# Altium schematic sheet CAN-Sheet.SchDoc
size A4; DocumentNumber: 6; SheetNumber: 6; SheetTotal: 8
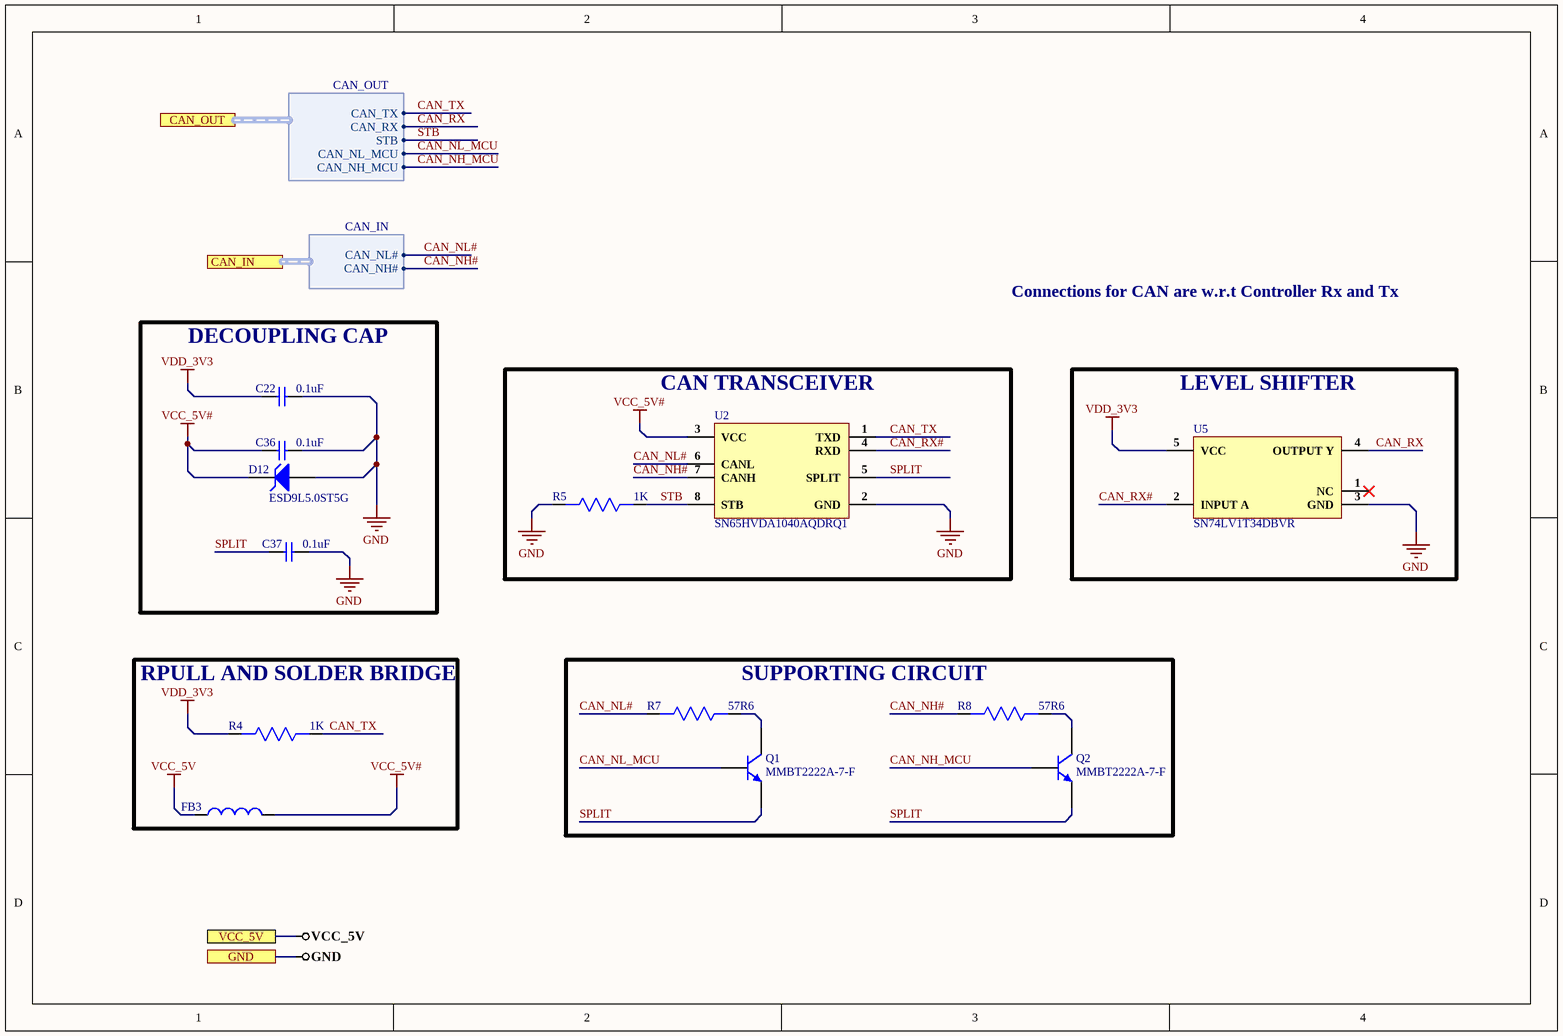
[diagram p0: CAN-Sheet.SchDoc]

## Parts
C22  0.1uF  [Cap 0603]
C36  0.1uF  [Cap0603]
C37  0.1uF  [Cap0603]
D12  ESD9L5.0ST5G  [SOD-923]
FB3  MPZ1608S121ATDH5  [MPZ1608S121ATDH5]  (value not drawn)
Q1  MMBT2222A-7-F  [SOT-23]
Q2  MMBT2222A-7-F  [SOT-23]
R4  1K  [Res0603]
R5  1K  [Res0603]
R7  57R6  [Res0603]
R8  57R6  [Res0603]
U2  SN65HVDA1040AQDRQ1  [SOIC-8]
U5  SN74LV1T34DBVR  [SOT-23-5]

## Blocks framed on the sheet
DECOUPLING CAP: C22 C36 C37 D12
CAN TRANSCEIVER: R5 U2
LEVEL SHIFTER: U5
RPULL AND SOLDER BRIDGE: FB3 R4
SUPPORTING CIRCUIT: Q1 Q2 R7 R8

## Ports
CAN_IN (harness CAN_IN), CAN_OUT (harness CAN_OUT), GND, VCC_5V

## Harnesses
CAN_OUT: CAN_TX, CAN_RX, STB, CAN_NL_MCU, CAN_NH_MCU
CAN_IN: CAN_NL#, CAN_NH#

## Nets
GND: C22.2 C36.2 C37.2 D12.2(A) R5.2 U2.2(GND) U5.3(GND) ; port GND
VCC_5V: FB3.1 ; port VCC_5V
VCC_5V#: C36.1 D12.1(K) FB3.2 U2.3(VCC)
VDD_3V3: C22.1 R4.2 U5.5(VCC)
CAN_NH#: R8.2 U2.7(CANH) ; port CAN_IN.CAN_NH#
CAN_NH_MCU: Q2.1(B) ; port CAN_OUT.CAN_NH_MCU
CAN_NL#: R7.2 U2.6(CANL) ; port CAN_IN.CAN_NL#
CAN_NL_MCU: Q1.1(B) ; port CAN_OUT.CAN_NL_MCU
CAN_RX: U5.4(OUTPUT_Y) ; port CAN_OUT.CAN_RX
CAN_RX#: U2.4(RXD) U5.2(INPUT_A)
CAN_TX: R4.1 U2.1(TXD) ; port CAN_OUT.CAN_TX
SPLIT: C37.1 Q1.2(E) Q2.2(E) U2.5(SPLIT)
STB: R5.1 U2.8(STB) ; port CAN_OUT.STB
NetQ1_3: Q1.3(C) R7.1
NetQ2_3: Q2.3(C) R8.1

Not connected (* = marked no-connect by the designer): U5 1(NC)*

## Notes on the sheet
- Connections for CAN are w.r.t Controller Rx and Tx

## Library data of the parts
C22 C36 C37 = CL10B104KB8NNNC: Cap Ceramic 0.1uF 50VDC X7R 10% SMD 0603 Paper T/R; Manufacturer: Samsung; Capacitance: 100nF; Voltage Rating: 50V; Supplier 1: Digi-Key; Manufacturer Part Number: CL10B104KB8NNNC; RoHS: Yes; Category: Ceramic Capacitors; Stock 1: 3998791; Pricing 1: 1=0.10000, 10=0.03000, 50=0.01640, 100=0.01340, 500=0.00954, 1000=0.00750 (USD); Mount: Surface Mount; Case/Package: 0603; Case Code (Metric): 1608; Case Code (Imperial): 0603; Material: Ceramic; Contact Plating: Tin; Min Operating Temperature: -55°C; Max Operating Temperature: 125°C; Dielectric: X7R; Tolerance: 10%; Package Quantity: 1; Packaging: Tape and Reel; Voltage: 50V; Voltage Rating (DC): 50V; Series: CL; Construction: Flat; Length: 1.6mm; Width: 0.031inch; Height: 0.8mm; Depth: 0.8mm; Thickness: 0.035inch; Radiation Hardening: No; Lead Free: Lead Free; RoHS Compliant: Yes; ComponentLink1URL: https://datasheet.ciiva.com/25803/cl10b104kb8nnnc-25803393.pdf?src-supplier=Digi-Key; ComponentLink1Description: https://datasheet.ciiva.com/25803/cl10b104kb8nnnc-25803393.pdf?src-supplier=Digi-Key; ComponentLink2URL: https://datasheet.ciiva.com/26838/getdatasheetpartid-89097-26838411.pdf?src-supplier=Verical; ComponentLink2Description: https://datasheet.ciiva.com/26838/getdatasheetpartid-89097-26838411.pdf?src-supplier=Verical; ComponentLink3URL: https://datasheet.ciiva.com/29198/456651-da-01-en-vs-kondensator-0605-29198839.pdf?src-supplier=Conrad; ComponentLink3Description: https://datasheet.ciiva.com/29198/456651-da-01-en-vs-kondensator-0605-29198839.pdf?src-supplier=Conrad; Supplier Part Number 1: 1276-1000-1-ND
D12 = ESD9L5.0ST5G: TVS DIODE 5V 9.8V SOD923; Manufacturer: ON Semiconductor; Capacitance: 0.9pF; Direction: Unidirectional; Number of Unidirectional Channels: 1; Min Breakdown Voltage: 5.4V; Power Line Protection: No; Leakage Current: 1uA; Element Configuration: Single; Peak Pulse Current: 1A; Diode Type: ZENER; Reverse Breakdown Voltage: 5.8V; Peak Pulse Power: 150mW; ESD Protection: Yes; Test Current: 1mA; Supplier 1: Digi-Key; Manufacturer Part Number: ESD9L5.0ST5G; RoHS: Yes; Category: ESD and Circuit Protection ICs; Stock 1: 558996; Pricing 1: 1=0.37000, 10=0.25600, 100=0.12500, 500=0.10426, 1000=0.07244, 2000=0.06278 (USD); Case/Package: SOD-923-2; Number of Pins: 2; Contact Plating: Tin,Matte; Min Operating Temperature: -55°C; Max Operating Temperature: 150°C; Package Quantity: 1; Packaging: Tape and Reel; Clamping Voltage: 9.8V; Reverse Standoff Voltage: 5V; Working Voltage: 5V; Resistor Type: Zener; Series: Automotive, AEC-Q101; Number of Elements: 1; Operating Supply Voltage: 5V; Max Surge Current: 1A; Breakdown Voltage: 5.4V; Number of Channels: 1; Polarity: Unidirectional; Termination: SMD/SMT; Max Reverse Leakage Current: 1uA; Max Breakdown Voltage: 5.4V; Number of Lines: 1; Power Dissipation: 150mW; Clamping Voltage-Max: 9.8V; Length: 0.8mm; Width: 0.65mm; Height: 0.4mm; Depth: 0.6mm; Radiation Hardening: No; Lead Free: Lead Free; RoHS Compliant: Yes; REACH SVHC: No SVHC; Halogen Free: Halogen Free; ComponentLink1URL: https://datasheet.ciiva.com/15143/getdatasheetpartid-185186-15143896.pdf?src-supplier=Verical; ComponentLink1Description: https://datasheet.ciiva.com/15143/getdatasheetpartid-185186-15143896.pdf?src-supplier=Verical; ComponentLink2URL: https://datasheet.ciiva.com/4510/esd9l-d-4510647.pdf?src-supplier=Mouser; ComponentLink2Description: https://datasheet.ciiva.com/4510/esd9l-d-4510647.pdf?src-supplier=Mouser; ComponentLink3URL: https://datasheet.ciiva.com/3304/esd9l-d-3304011.pdf?src-supplier=Avnet; ComponentLink3Description: https://datasheet.ciiva.com/3304/esd9l-d-3304011.pdf?src-supplier=Avnet; ComponentLink4URL: https://datasheet.ciiva.com/16437/esd9l-d-16437835.pdf?src-supplier=Future+Electronics; ComponentLink4Description: https://datasheet.ciiva.com/16437/esd9l-d-16437835.pdf?src-supplier=Future+Electronics; ComponentLink5URL: https://datasheet.ciiva.com/339/esd9l-d-339853.pdf?src-supplier=Digi-Key; ComponentLink5Description: https://datasheet.ciiva.com/339/esd9l-d-339853.pdf?src-supplier=Digi-Key; ComponentLink6URL: https://datasheet.ciiva.com/339/esd9l-d-339854.pdf?src-supplier=Digi-Key; ComponentLink6Description: https://datasheet.ciiva.com/339/esd9l-d-339854.pdf?src-supplier=Digi-Key; ComponentLink7URL: https://datasheet.ciiva.com/11195/esd9l-d-11195342.pdf?src-supplier=Avnet; ComponentLink7Description: https://datasheet.ciiva.com/11195/esd9l-d-11195342.pdf?src-supplier=Avnet; ComponentLink8URL: https://datasheet.ciiva.com/25958/esd9l-d-25958446.pdf?src-supplier=Avnet+Europe; ComponentLink8Description: https://datasheet.ciiva.com/25958/esd9l-d-25958446.pdf?src-supplier=Avnet+Europe; ComponentLink9URL: https://datasheet.ciiva.com/339/esd9l-d-339855.pdf?src-supplier=Digi-Key; ComponentLink9Description: https://datasheet.ciiva.com/339/esd9l-d-339855.pdf?src-supplier=Digi-Key; Supplier Part Number 1: ESD9L5.0ST5GOSCT-ND
FB3 = MPZ1608S121ATDH5: Ferrite Beads Multi-Layer 120Ohm 25% 100MHz 2A 45mOhm DCR 0603 Automotive T/R; Manufacturer: TDK; Number of Lines: 1; DC Resistance (DCR): 45mR; Impedance: 120R; Supplier 1: Digi-Key; Manufacturer Part Number: MPZ1608S121ATDH5; RoHS: Yes; Category: Ferrite Beads and Chips; Pricing 1: 1=0.11000, 10=0.08600, 25=0.07720, 50=0.05660, 100=0.04890, 250=0.03860, 500=0.03260, 1000=0.02746 (USD); Mount: Surface Mount; Case/Package: 0603; Case Code (Metric): 1608; Case Code (Imperial): 0603; Weight: 7.1E-05oz; Min Operating Temperature: -55°C; Max Operating Temperature: 125°C; Package Quantity: 4000; Packaging: Tape and Reel; Max Current Rating: 2A; Termination: SMD/SMT; Max DC Current: 2A; Tolerance: 25%; Test Frequency: 100MHz; Length: 0.063inch; Width: 0.031inch; Height: 0.03inch; Ratings: AEC-Q200; RoHS Compliant: Yes; ComponentLink1URL: https://media.digikey.com/pdf/Data%20Sheets/TDK%20PDFs/MPZ_Series_Br.pdf?src-supplier=Digi-Key; ComponentLink1Description: https://media.digikey.com/pdf/Data%20Sheets/TDK%20PDFs/MPZ_Series_Br.pdf?src-supplier=Digi-Key; ComponentLink2URL: http://www.mouser.com/ds/2/400/eads_commercial_power_mpz1608_en-923650.pdf?src-supplier=Mouser; ComponentLink2Description: http://www.mouser.com/ds/2/400/eads_commercial_power_mpz1608_en-923650.pdf?src-supplier=Mouser; ComponentLink3URL: https://product.tdk.com/info/en/catalog/datasheets/beads_automotive_power_mpz1608_en.pdf?src-supplier=Digi-Key; ComponentLink3Description: https://product.tdk.com/info/en/catalog/datasheets/beads_automotive_power_mpz1608_en.pdf?src-supplier=Digi-Key; Supplier Part Number 1: 445-172891-6-ND
Q1 Q2 = MMBT2222A-7-F: TRANS NPN 40V 0.6A SMD SOT23-3; Manufacturer: Diodes; Max Power Dissipation: 300mW; Collector Base Voltage (VCBO): 75V; Max Collector Current: 600mA; hFE Min: 100; Frequency: 300MHz; Number of Elements: 1; Emitter Base Voltage (VEBO): 6V; Collector Emitter Saturation Voltage: 1V; Power Dissipation: 350mW; Element Configuration: Single; Current: 1A; Supplier 1: Digi-Key; Manufacturer Part Number: MMBT2222A-7-F; Stock 1: 2471182; Pricing 1: 1=0.15, 10=0.134, 100=0.0729, 500=0.04486, 1000=0.03059 (USD); Mount: Surface Mount; Case/Package: SOT-23; Number of Pins: 3; Weight: 0.000282oz; Contact Plating: Matte,Tin; Min Operating Temperature: -55°C; Max Operating Temperature: 150°C; Packaging: Tape and Reel; Collector Emitter Voltage (VCEO): 40V; Polarity: NPN; Voltage Rating (DC): 40V; Package Quantity: 3000; Continuous Collector Current: 600mA; Collector Emitter Breakdown Voltage: 40V; Transition Frequency: 300MHz; Max Breakdown Voltage: 40V; Max Frequency: 300MHz; Termination: SMD/SMT; Gain Bandwidth Product: 300MHz; Current Rating: 600mA; Voltage: 40V; Length: 3.05mm; Height: 1mm; Width: 1.4mm; Radiation Hardening: No; Lead Free: Lead Free; REACH SVHC: No SVHC; ComponentLink1URL: http://www.diodes.com/datasheets/ds30041.pdf?src-supplier=Future+Electronics; ComponentLink1Description: http://www.diodes.com/datasheets/ds30041.pdf?src-supplier=Future+Electronics; ComponentLink2URL: http://www.diodes.com/datasheets/ds30041.pdf?src-supplier=Avnet; ComponentLink2Description: http://www.diodes.com/datasheets/ds30041.pdf?src-supplier=Avnet; ComponentLink3URL: https://www.verical.com/server-webapp/html/getDatasheet?partID=82692&src-supplier=Verical; ComponentLink3Description: https://www.verical.com/server-webapp/html/getDatasheet?partID=82692&src-supplier=Verical; ComponentLink4URL: https://www.diodes.com/assets/Datasheets/ds30041.pdf?src-supplier=Digi-Key; ComponentLink4Description: https://www.diodes.com/assets/Datasheets/ds30041.pdf?src-supplier=Digi-Key; ComponentLink5URL: http://www.diodes.com/datasheets/ds30041.pdf?src-supplier=Avnet+Europe; ComponentLink5Description: http://www.diodes.com/datasheets/ds30041.pdf?src-supplier=Avnet+Europe; ComponentLink6URL: http://www.diodes.com/datasheets/ds30041.pdf?src-supplier=Element14; ComponentLink6Description: http://www.diodes.com/datasheets/ds30041.pdf?src-supplier=Element14; Supplier Part Number 1: MMBT2222A-FDIDKR-ND
R4 R5 = RC0603JR-071KL: RES SMD 1K 0.1W 0603  75 V, Thick Film; Manufacturer: Yageo; Resistance: 1kR; Tolerance: 5%; Temperature Coefficient: 100ppm/°C; Voltage Rating (DC): 50V; Power Rating: 100mW; Body Length: 1.6mm; Supplier 1: Digi-Key; Manufacturer Part Number: RC0603JR-071KL; RoHS: Yes; Category: Chip SMD Resistors; Stock 1: 1727570; Pricing 1: 1=0.10000, 10=0.02000, 100=0.00800, 1000=0.00360, 2500=0.00312 (USD); Case/Package: 0603; Number of Pins: 2; Contact Plating: Tin,Matte; Case Code (Imperial): 0603; Case Code (Metric): 1608; Size Code: 0603; Min Operating Temperature: -55°C; Max Operating Temperature: 155°C; Resistor Type: Thick Film; Packaging: Tape and Reel; Package Quantity: 5000; Voltage Rating: 50V; Termination: SMD/SMT; Series: RC; Resistance Tolerance: 5%; Construction: Rectangular; Length: 1.6mm; Width: 0.8mm; Height: 0.45mm; Depth: 0.8mm; Radiation Hardening: No; REACH SVHC: Unknown; Lead Free: Lead Free; Military Standard: Not; RoHS Compliant: Yes; Supplier Part Number 1: 311-1.0KGRCT-ND
R7 R8 = RC0603FR-0757R6L: RES SMD 57.6 OHM 1% 1/10W 0603; Manufacturer: Yageo; Resistance: 57.6R; Temperature Coefficient: 100ppm/°C; Power Rating: 100mW; Voltage Rating: 50V; Supplier 1: Digi-Key; Manufacturer Part Number: RC0603FR-0757R6L; RoHS: Yes; Category: Chip SMD Resistors; Stock 1: 27520; Pricing 1: 1=0.10000, 10=0.02400, 100=0.00970, 1000=0.00436, 2500=0.00378 (USD); Case/Package: 0603; Contact Plating: Tin,Matte; Case Code (Metric): 1608; Case Code (Imperial): 0603; Min Operating Temperature: -55°C; Max Operating Temperature: 155°C; Tolerance: 1%; Resistor Type: Thick Film; Package Quantity: 1; Packaging: Tape and Reel; Number of Terminations: 2; Termination: SMD/SMT; Max Power Dissipation: 100mW; Voltage Rating (DC): 50V; Features: Moisture Resistant; Series: RC; Construction: Rectangular; Length: 1.6mm; Width: 0.031inch; Height: 0.022inch; Depth: 0.8mm; Military Standard: Not; Lead Free: Lead Free; RoHS Compliant: Yes; ComponentLink1URL: https://datasheet.ciiva.com/2455/pyu-r-int-thick-7-2455376.pdf?src-supplier=Digi-Key; ComponentLink1Description: https://datasheet.ciiva.com/2455/pyu-r-int-thick-7-2455376.pdf?src-supplier=Digi-Key; ComponentLink2URL: https://datasheet.ciiva.com/28398/pyu-rc0603-51-rohs-l-4-28398203.pdf?src-supplier=Avnet+Europe; ComponentLink2Description: https://datasheet.ciiva.com/28398/pyu-rc0603-51-rohs-l-4-28398203.pdf?src-supplier=Avnet+Europe; ComponentLink3URL: https://datasheet.ciiva.com/2455/pyu-r-int-thick-7-2455374.pdf?src-supplier=Digi-Key; ComponentLink3Description: https://datasheet.ciiva.com/2455/pyu-r-int-thick-7-2455374.pdf?src-supplier=Digi-Key; ComponentLink4URL: https://datasheet.ciiva.com/12561/rc0603-272842-12561230.pdf?src-supplier=Mouser; ComponentLink4Description: https://datasheet.ciiva.com/12561/rc0603-272842-12561230.pdf?src-supplier=Mouser; ComponentLink5URL: https://datasheet.ciiva.com/2455/pyu-r-int-thick-7-2455375.pdf?src-supplier=Digi-Key; ComponentLink5Description: https://datasheet.ciiva.com/2455/pyu-r-int-thick-7-2455375.pdf?src-supplier=Digi-Key; Supplier Part Number 1: 311-57.6HRCT-ND
U2 = SN65HVDA1040AQDRQ1: IC TRANSCEIVER HALF 1/1 8SOIC; Manufacturer: Texas Instruments; Number of Transmit Buffers: 1; Min Supply Voltage: 4.75V; Max Supply Voltage: 5.25V; Data Rate: 1Mbps; Operating Supply Voltage: 5V; Nominal Supply Current: 70mA; Supplier 1: Arrow Electronics; Manufacturer Part Number: SN65HVDA1040AQDRQ1; RoHS: Yes; Category: Interface ICs; Stock 1: 20; Pricing 1: 1=1.73580, 10=1.50150 (USD); Case/Package: D; Number of Pins: 8; Contact Plating: Gold; Min Operating Temperature: -40°C; Max Operating Temperature: 125°C; Number of Receive Buffers: 1; Packaging: Tape and Reel; Package Quantity: 2500; Number of Transceivers: 1; Max Supply Current: 70mA; Series: -; Supply Current: 70mA; Radiation Hardening: No; REACH SVHC: No SVHC; Lead Free: Lead Free; RoHS Compliant: Yes; ComponentLink1URL: https://datasheet.ciiva.com/28652/1787993-28652354.pdf?src-supplier=Element14; ComponentLink1Description: https://datasheet.ciiva.com/28652/1787993-28652354.pdf?src-supplier=Element14; ComponentLink2URL: https://datasheet.ciiva.com/41461/001187135-da-01-en-ic-transcv-sn65hvda1040aqdrq1-soic-8-tid-41461891.pdf?src-supplier=Conrad; ComponentLink2Description: https://datasheet.ciiva.com/41461/001187135-da-01-en-ic-transcv-sn65hvda1040aqdrq1-soic-8-tid-41461891.pdf?src-supplier=Conrad; ComponentLink3URL: https://datasheet.ciiva.com/1766/sn65hvda1040a-q1-1766439.pdf?src-supplier=Digi-Key; ComponentLink3Description: https://datasheet.ciiva.com/1766/sn65hvda1040a-q1-1766439.pdf?src-supplier=Digi-Key; ComponentLink4URL: https://datasheet.ciiva.com/1766/sn65hvda1040a-q1-1766438.pdf?src-supplier=Digi-Key; ComponentLink4Description: https://datasheet.ciiva.com/1766/sn65hvda1040a-q1-1766438.pdf?src-supplier=Digi-Key; ComponentLink5URL: https://datasheet.ciiva.com/1766/sn65hvda1040a-q1-1766440.pdf?src-supplier=Digi-Key; ComponentLink5Description: https://datasheet.ciiva.com/1766/sn65hvda1040a-q1-1766440.pdf?src-supplier=Digi-Key; ComponentLink6URL: https://datasheet.ciiva.com/15150/getdatasheetpartid-184324-15150727.pdf?src-supplier=Verical; ComponentLink6Description: https://datasheet.ciiva.com/15150/getdatasheetpartid-184324-15150727.pdf?src-supplier=Verical; Supplier Part Number 1: SN65HVDA1040AQDRQ1
U5 = SN74LV1T34DBVR: IC BUF NON-INVERT 5.5V SOT23-5; Manufacturer: Texas Instruments; Number of Elements: 1; Logic Function: Buffer,Inverting; High Level Output Current: -8mA; Low Level Output Current: 8mA; Min Supply Voltage: 1.6V; Polarity: Non-Inverting; Propagation Delay: 15.5ns; Quiescent Current: 1uA; Supplier 1: Digi-Key; Manufacturer Part Number: SN74LV1T34DBVR; Stock 1: 37360; Pricing 1: 1=0.43, 10=0.349, 25=0.3192, 100=0.2374, 250=0.2152, 500=0.17808, 1000=0.13356 (USD); Mount: Surface Mount; Case/Package: SOT-23-5; Number of Pins: 5; Weight: 0.000353oz; Min Operating Temperature: -40°C; Max Operating Temperature: 125°C; Packaging: Tape and Reel; Number of Bits per Element: 1; Number of Bits: 1; Package Quantity: 3000; Max Supply Voltage: 5.5V; Number of Input Lines: 1; Number of Output Lines: 1; Operating Supply Current: 8mA; Number of Channels: 1; Number of Inputs: 1; Number of Outputs: 1; Radiation Hardening: No; RoHS Compliant: Yes; REACH SVHC: No SVHC; Lead Free: Lead Free; ComponentLink1URL: http://www.ti.com/lit/pdf/sdyu001?src-supplier=Digi-Key; ComponentLink1Description: http://www.ti.com/lit/pdf/sdyu001?src-supplier=Digi-Key; ComponentLink2URL: http://www.ti.com/lit/ds/symlink/sn74lv1t34.pdf?src-supplier=Avnet; ComponentLink2Description: http://www.ti.com/lit/ds/symlink/sn74lv1t34.pdf?src-supplier=Avnet; Supplier Part Number 1: 296-37176-6-ND